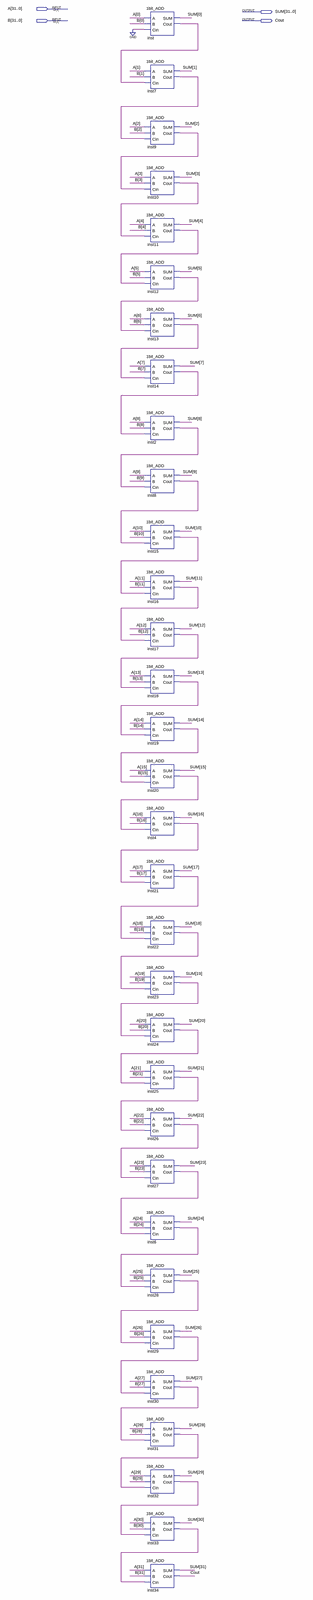
[diagram p0: schematic sheet, whole]
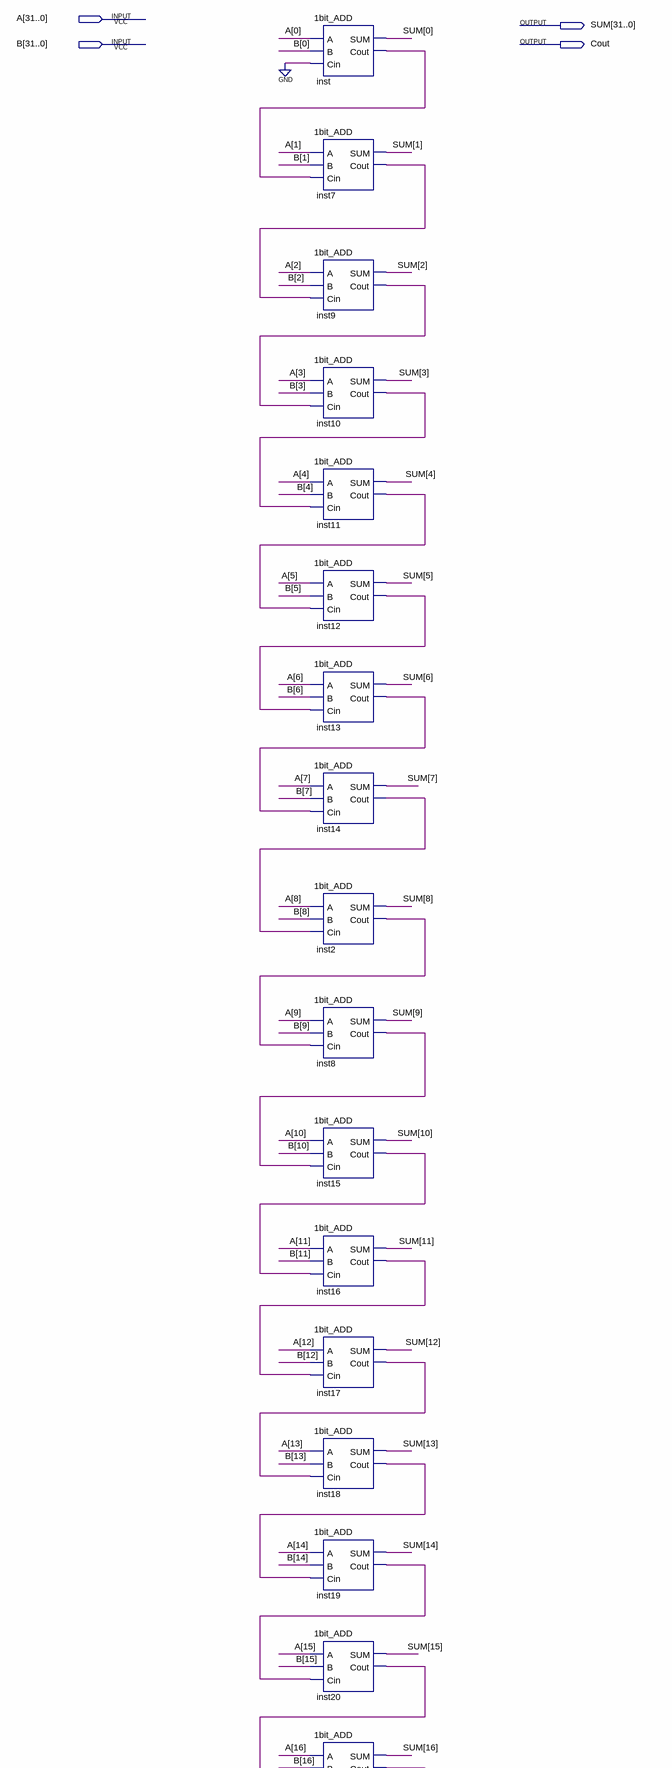
[diagram p1: schematic sheet, upper part]
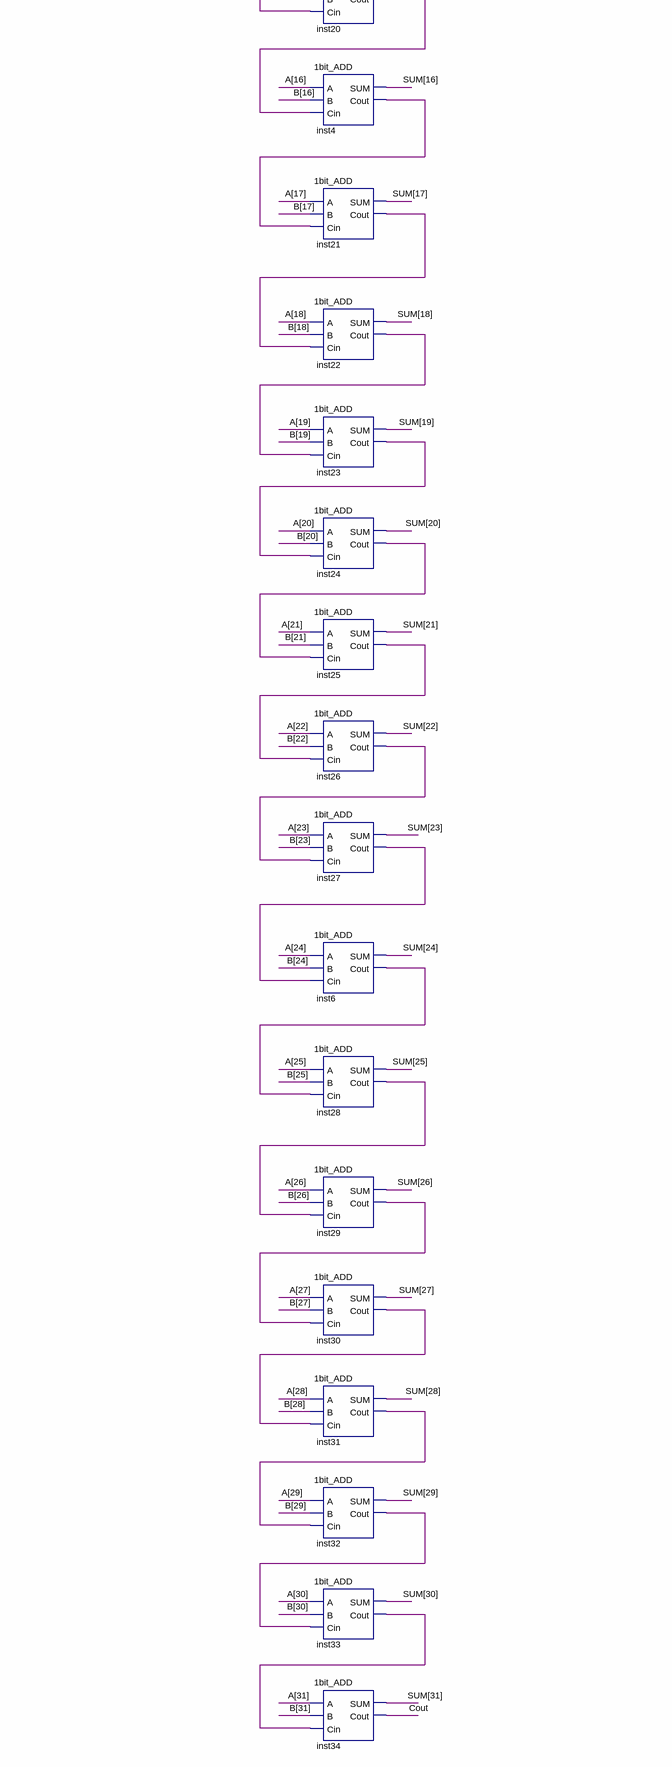
[diagram p2: schematic sheet, lower part]
// Quartus schematic 32bit_ADD.bdf as structural Verilog: 32 symbols, 4 pins
module \32bit_ADD  (
  input  [31:0] A,
  input  [31:0] B,
  output [31:0] SUM,
  output Cout
);

  wire inst2_cout, inst4_cout, inst6_cout, inst7_cout, inst8_cout, inst9_cout, inst10_cout, inst11_cout,
       inst12_cout, inst13_cout, inst14_cout, inst15_cout, inst16_cout, inst17_cout, inst18_cout,
       inst19_cout, inst20_cout, inst21_cout, inst22_cout, inst23_cout, inst24_cout, inst25_cout,
       inst26_cout, inst27_cout, inst28_cout, inst29_cout, inst30_cout, inst31_cout, inst32_cout,
       inst33_cout, inst_cout;

  \1bit_ADD  inst (.A(A[0]), .B(B[0]), .Cin(1'b0), .SUM(SUM[0]), .Cout(inst_cout));
  \1bit_ADD  inst7 (.A(A[1]), .B(B[1]), .Cin(inst_cout), .SUM(SUM[1]), .Cout(inst7_cout));
  \1bit_ADD  inst9 (.A(A[2]), .B(B[2]), .Cin(inst7_cout), .SUM(SUM[2]), .Cout(inst9_cout));
  \1bit_ADD  inst10 (.A(A[3]), .B(B[3]), .Cin(inst9_cout), .SUM(SUM[3]), .Cout(inst10_cout));
  \1bit_ADD  inst11 (.A(A[4]), .B(B[4]), .Cin(inst10_cout), .SUM(SUM[4]), .Cout(inst11_cout));
  \1bit_ADD  inst12 (.A(A[5]), .B(B[5]), .Cin(inst11_cout), .SUM(SUM[5]), .Cout(inst12_cout));
  \1bit_ADD  inst13 (.A(A[6]), .B(B[6]), .Cin(inst12_cout), .SUM(SUM[6]), .Cout(inst13_cout));
  \1bit_ADD  inst14 (.A(A[7]), .B(B[7]), .Cin(inst13_cout), .SUM(SUM[7]), .Cout(inst14_cout));
  \1bit_ADD  inst2 (.A(A[8]), .B(B[8]), .Cin(inst14_cout), .SUM(SUM[8]), .Cout(inst2_cout));
  \1bit_ADD  inst8 (.A(A[9]), .B(B[9]), .Cin(inst2_cout), .SUM(SUM[9]), .Cout(inst8_cout));
  \1bit_ADD  inst15 (.A(A[10]), .B(B[10]), .Cin(inst8_cout), .SUM(SUM[10]), .Cout(inst15_cout));
  \1bit_ADD  inst16 (.A(A[11]), .B(B[11]), .Cin(inst15_cout), .SUM(SUM[11]), .Cout(inst16_cout));
  \1bit_ADD  inst17 (.A(A[12]), .B(B[12]), .Cin(inst16_cout), .SUM(SUM[12]), .Cout(inst17_cout));
  \1bit_ADD  inst18 (.A(A[13]), .B(B[13]), .Cin(inst17_cout), .SUM(SUM[13]), .Cout(inst18_cout));
  \1bit_ADD  inst19 (.A(A[14]), .B(B[14]), .Cin(inst18_cout), .SUM(SUM[14]), .Cout(inst19_cout));
  \1bit_ADD  inst20 (.A(A[15]), .B(B[15]), .Cin(inst19_cout), .SUM(SUM[15]), .Cout(inst20_cout));
  \1bit_ADD  inst4 (.A(A[16]), .B(B[16]), .Cin(inst20_cout), .SUM(SUM[16]), .Cout(inst4_cout));
  \1bit_ADD  inst21 (.A(A[17]), .B(B[17]), .Cin(inst4_cout), .SUM(SUM[17]), .Cout(inst21_cout));
  \1bit_ADD  inst22 (.A(A[18]), .B(B[18]), .Cin(inst21_cout), .SUM(SUM[18]), .Cout(inst22_cout));
  \1bit_ADD  inst23 (.A(A[19]), .B(B[19]), .Cin(inst22_cout), .SUM(SUM[19]), .Cout(inst23_cout));
  \1bit_ADD  inst24 (.A(A[20]), .B(B[20]), .Cin(inst23_cout), .SUM(SUM[20]), .Cout(inst24_cout));
  \1bit_ADD  inst25 (.A(A[21]), .B(B[21]), .Cin(inst24_cout), .SUM(SUM[21]), .Cout(inst25_cout));
  \1bit_ADD  inst26 (.A(A[22]), .B(B[22]), .Cin(inst25_cout), .SUM(SUM[22]), .Cout(inst26_cout));
  \1bit_ADD  inst27 (.A(A[23]), .B(B[23]), .Cin(inst26_cout), .SUM(SUM[23]), .Cout(inst27_cout));
  \1bit_ADD  inst6 (.A(A[24]), .B(B[24]), .Cin(inst27_cout), .SUM(SUM[24]), .Cout(inst6_cout));
  \1bit_ADD  inst28 (.A(A[25]), .B(B[25]), .Cin(inst6_cout), .SUM(SUM[25]), .Cout(inst28_cout));
  \1bit_ADD  inst29 (.A(A[26]), .B(B[26]), .Cin(inst28_cout), .SUM(SUM[26]), .Cout(inst29_cout));
  \1bit_ADD  inst30 (.A(A[27]), .B(B[27]), .Cin(inst29_cout), .SUM(SUM[27]), .Cout(inst30_cout));
  \1bit_ADD  inst31 (.A(A[28]), .B(B[28]), .Cin(inst30_cout), .SUM(SUM[28]), .Cout(inst31_cout));
  \1bit_ADD  inst32 (.A(A[29]), .B(B[29]), .Cin(inst31_cout), .SUM(SUM[29]), .Cout(inst32_cout));
  \1bit_ADD  inst33 (.A(A[30]), .B(B[30]), .Cin(inst32_cout), .SUM(SUM[30]), .Cout(inst33_cout));
  \1bit_ADD  inst34 (.A(A[31]), .B(B[31]), .Cin(inst33_cout), .SUM(SUM[31]), .Cout(Cout));
endmodule
